# Altium project Led Strip 1-3W.PrjPcb
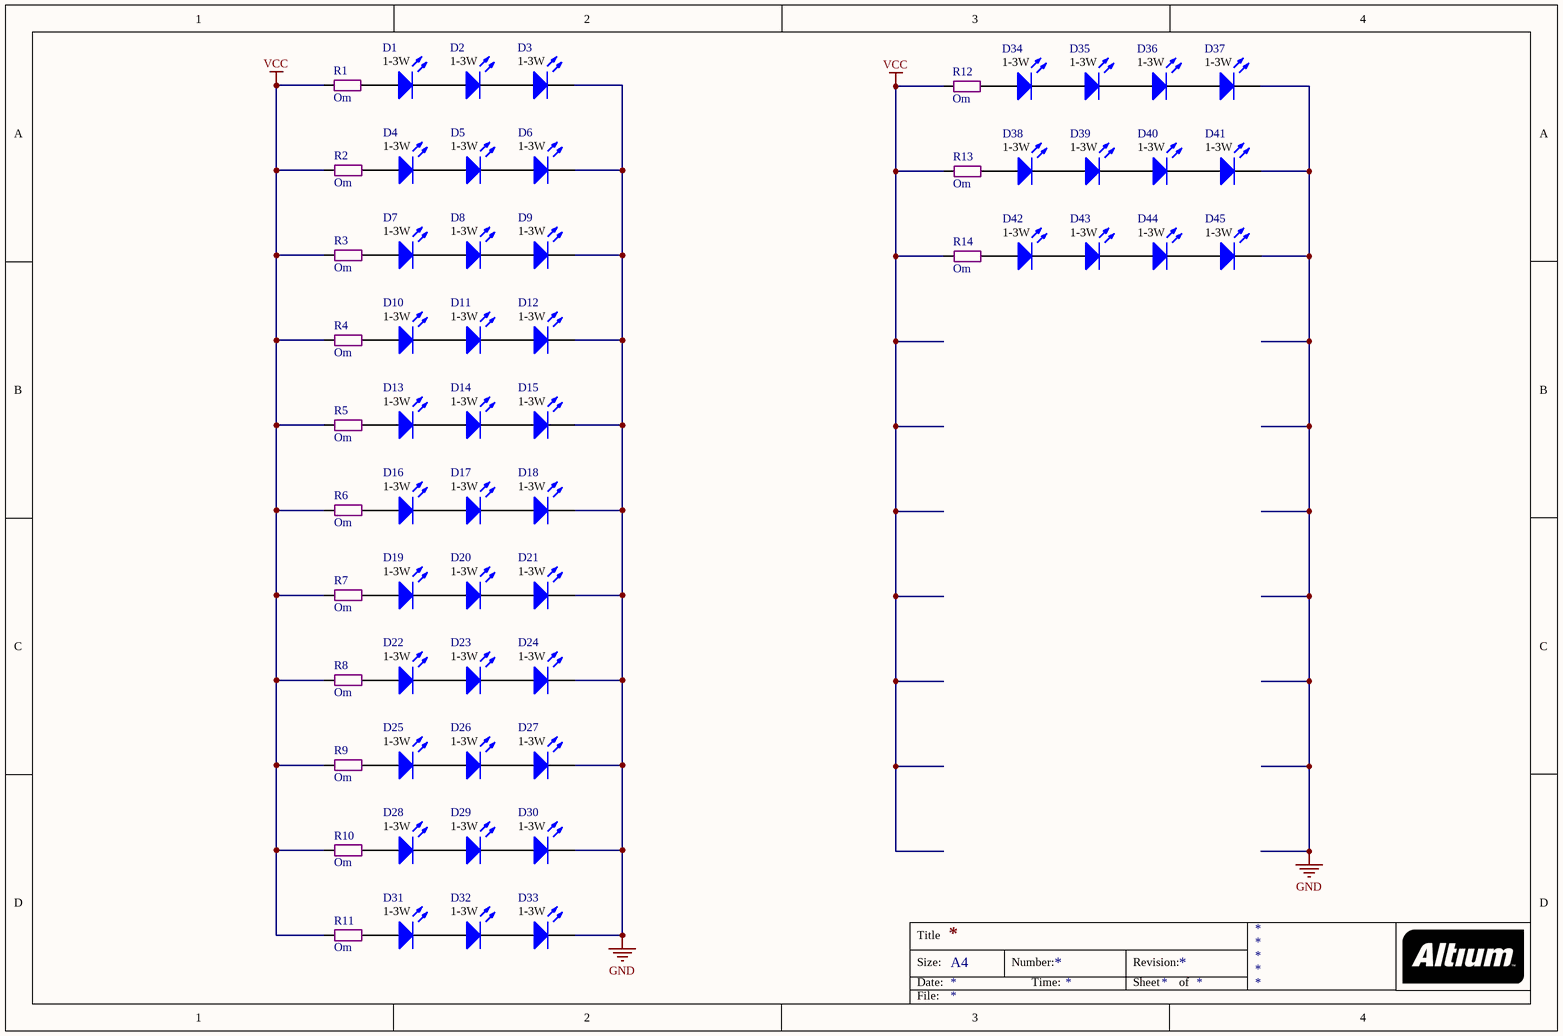
[diagram p0: Led Strip 1-3W.SchDoc]
1 sheet, 59 parts. Net scope: global (net labels, ports and power ports of the same name join across sheets).
Board file: Led Strip 1-3W.PcbDoc

## Sheet Led Strip 1-3W.SchDoc
size A4

### Parts
D1  (no value)  [LED SMD 1W 3W]
D2  (no value)  [LED SMD 1W 3W]
D3  (no value)  [LED SMD 1W 3W]
D4  (no value)  [LED SMD 1W 3W]
D5  (no value)  [LED SMD 1W 3W]
D6  (no value)  [LED SMD 1W 3W]
D7  (no value)  [LED SMD 1W 3W]
D8  (no value)  [LED SMD 1W 3W]
D9  (no value)  [LED SMD 1W 3W]
D10  (no value)  [LED SMD 1W 3W]
D11  (no value)  [LED SMD 1W 3W]
D12  (no value)  [LED SMD 1W 3W]
D13  (no value)  [LED SMD 1W 3W]
D14  (no value)  [LED SMD 1W 3W]
D15  (no value)  [LED SMD 1W 3W]
D16  (no value)  [LED SMD 1W 3W]
D17  (no value)  [LED SMD 1W 3W]
D18  (no value)  [LED SMD 1W 3W]
D19  (no value)  [LED SMD 1W 3W]
D20  (no value)  [LED SMD 1W 3W]
D21  (no value)  [LED SMD 1W 3W]
D22  (no value)  [LED SMD 1W 3W]
D23  (no value)  [LED SMD 1W 3W]
D24  (no value)  [LED SMD 1W 3W]
D25  (no value)  [LED SMD 1W 3W Compact]
D26  (no value)  [LED SMD 1W 3W Compact]
D27  (no value)  [LED SMD 1W 3W Compact]
D28  (no value)  [LED SMD 1W 3W Compact]
D29  (no value)  [LED SMD 1W 3W Compact]
D30  (no value)  [LED SMD 1W 3W Compact]
D31  (no value)  [LED SMD 1W 3W Compact]
D32  (no value)  [LED SMD 1W 3W Compact]
D33  (no value)  [LED SMD 1W 3W Compact]
D34  (no value)  [LED SMD 1W 3W Compact]
D35  (no value)  [LED SMD 1W 3W Compact]
D36  (no value)  [LED SMD 1W 3W Compact]
D37  (no value)  [LED SMD 1W 3W Compact]
D38  (no value)  [LED SMD 1W 3W Compact]
D39  (no value)  [LED SMD 1W 3W Compact]
D40  (no value)  [LED SMD 1W 3W Compact]
D41  (no value)  [LED SMD 1W 3W Compact]
D42  (no value)  [LED SMD 1W 3W Compact]
D43  (no value)  [LED SMD 1W 3W Compact]
D44  (no value)  [LED SMD 1W 3W Compact]
D45  (no value)  [LED SMD 1W 3W Compact]
R1  Om  [SMD 1206 (3216)]
R2  Om  [SMD 1206 (3216)]
R3  Om  [SMD 1206 (3216)]
R4  Om  [SMD 1206 (3216)]
R5  Om  [SMD 1206 (3216)]
R6  Om  [SMD 1206 (3216)]
R7  Om  [SMD 1206 (3216)]
R8  Om  [SMD 1206 (3216)]
R9  Om  [SMD 1206 (3216)]
R10  Om  [SMD 1206 (3216)]
R11  Om  [SMD 1206 (3216)]
R12  Om  [SMD 1206 (3216)]
R13  Om  [SMD 1206 (3216)]
R14  Om  [SMD 1206 (3216)]

### Nets
GND: D3.K D6.K D9.K D12.K D15.K D18.K D21.K D24.K D27.K D30.K D33.K D37.K D41.K D45.K
VCC: R1.1 R2.1 R3.1 R4.1 R5.1 R6.1 R7.1 R8.1 R9.1 R10.1 R11.1 R12.1 R13.1 R14.1
NetD1_A: D1.A R1.2
NetD1_K: D1.K D2.A
NetD2_K: D2.K D3.A
NetD4_A: D4.A R2.2
NetD4_K: D4.K D5.A
NetD5_K: D5.K D6.A
NetD7_A: D7.A R3.2
NetD7_K: D7.K D8.A
NetD8_K: D8.K D9.A
NetD10_A: D10.A R4.2
NetD10_K: D10.K D11.A
NetD11_K: D11.K D12.A
NetD13_A: D13.A R5.2
NetD13_K: D13.K D14.A
NetD14_K: D14.K D15.A
NetD16_A: D16.A R6.2
NetD16_K: D16.K D17.A
NetD17_K: D17.K D18.A
NetD19_A: D19.A R7.2
NetD19_K: D19.K D20.A
NetD20_K: D20.K D21.A
NetD22_A: D22.A R8.2
NetD22_K: D22.K D23.A
NetD23_K: D23.K D24.A
NetD25_A: D25.A R9.2
NetD25_K: D25.K D26.A
NetD26_K: D26.K D27.A
NetD28_A: D28.A R10.2
NetD28_K: D28.K D29.A
NetD29_K: D29.K D30.A
NetD31_A: D31.A R11.2
NetD31_K: D31.K D32.A
NetD32_K: D32.K D33.A
NetD34_A: D34.A R12.2
NetD34_K: D34.K D35.A
NetD35_K: D35.K D36.A
NetD36_K: D36.K D37.A
NetD38_A: D38.A R13.2
NetD38_K: D38.K D39.A
NetD39_K: D39.K D40.A
NetD40_K: D40.K D41.A
NetD42_A: D42.A R14.2
NetD42_K: D42.K D43.A
NetD43_K: D43.K D44.A
NetD44_K: D44.K D45.A

### Notes on the sheet
- Title
- Size:
- Date:
- A4
- Number:
- Time:
- Revision:
- Sheet
- of
- File:

### Library data of the parts
D1-D45 = Led 1-3W: 1-3W; Color: Any
R1-R14 = Res SMD 1206